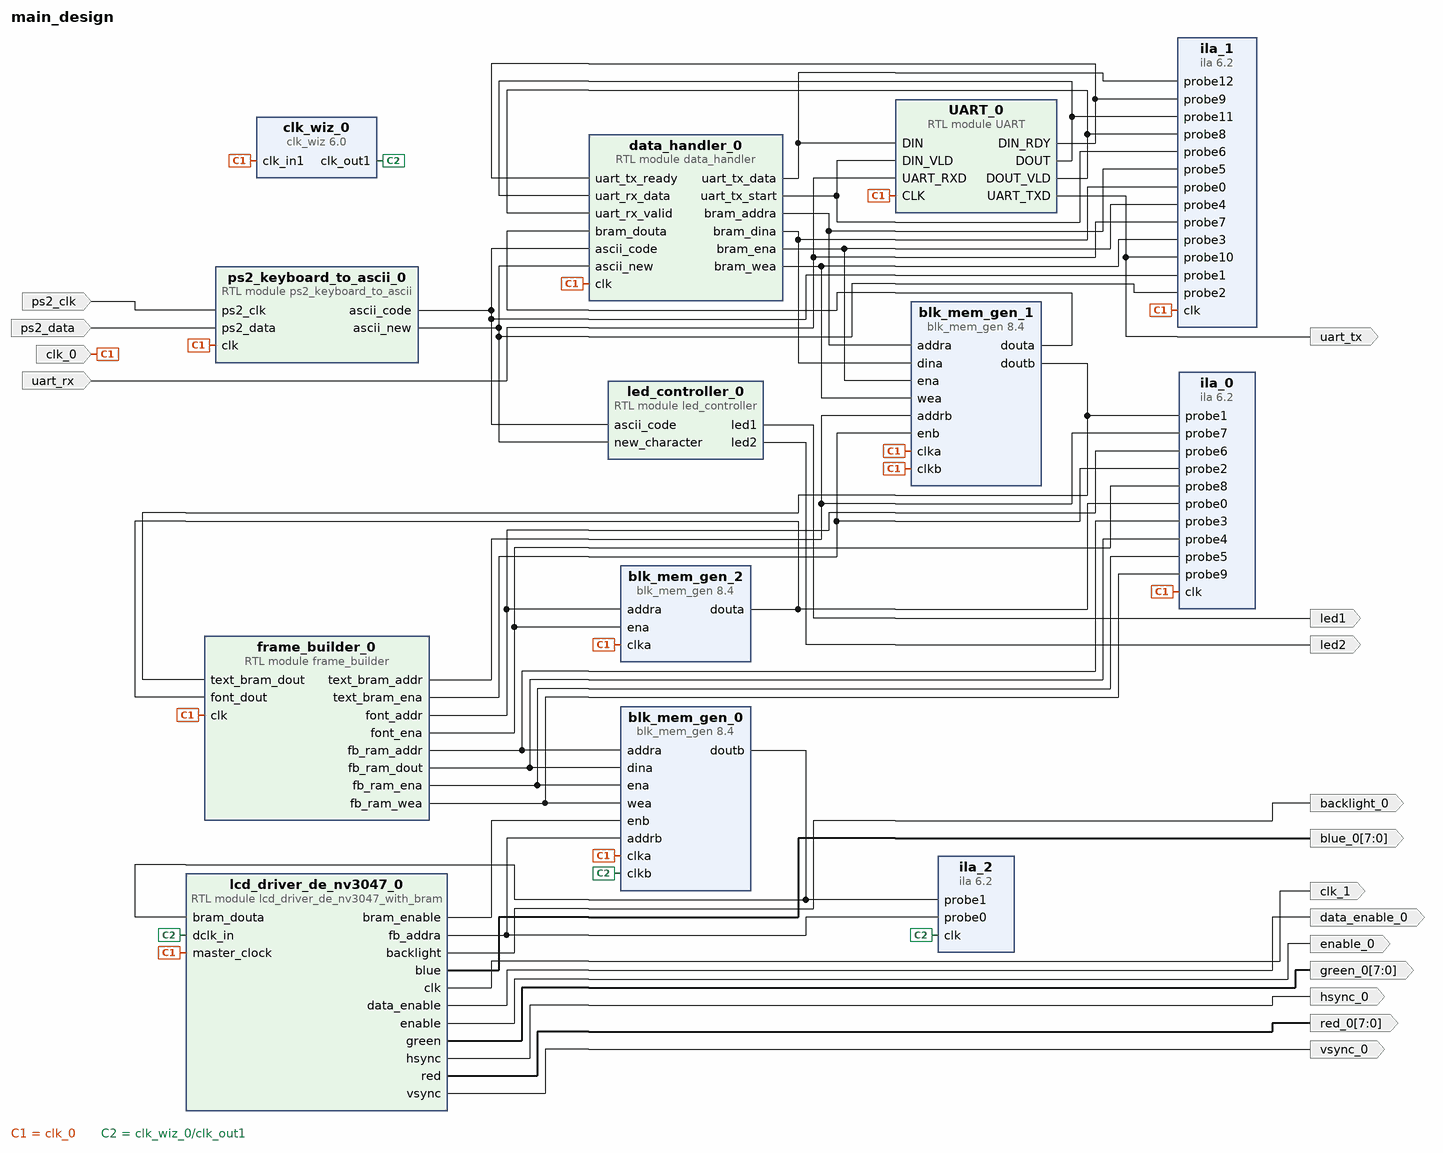
[diagram p0: block diagram of the top level]
# Vivado block design main_design, xc7a100tfgg676-1, Vivado 2025.1
create_bd_design main_design

create_bd_port -dir I -type clk clk_0
set_property -dict {CONFIG.FREQ_HZ 50000000} [get_bd_ports clk_0]
create_bd_port -dir O -type data led1
create_bd_port -dir O led2
create_bd_port -dir I -type data ps2_data
create_bd_port -dir I -type clk ps2_clk
set_property -dict {CONFIG.CLK_DOMAIN main_design_ps2_clk_0 CONFIG.FREQ_HZ 100000000} [get_bd_ports ps2_clk]
create_bd_port -dir I -type data uart_rx
create_bd_port -dir O -type data uart_tx
create_bd_port -dir O -from 7 -to 0 red_0
create_bd_port -dir O -from 7 -to 0 green_0
create_bd_port -dir O -from 7 -to 0 blue_0
create_bd_port -dir O enable_0
create_bd_port -dir O -type clk clk_1
create_bd_port -dir O hsync_0
create_bd_port -dir O vsync_0
create_bd_port -dir O data_enable_0
create_bd_port -dir O backlight_0

create_bd_cell -type module -reference ps2_keyboard_to_ascii ps2_keyboard_to_ascii_0
create_bd_cell -type module -reference led_controller led_controller_0
create_bd_cell -type module -reference UART UART_0
create_bd_cell -type ip -vlnv xilinx.com:ip:clk_wiz:6.0 clk_wiz_0
set_property -dict [list \
  CONFIG.CLKIN1_JITTER_PS 200.0 \
  CONFIG.CLKOUT1_DRIVES BUFG \
  CONFIG.CLKOUT1_JITTER 302.798 \
  CONFIG.CLKOUT1_PHASE_ERROR 161.614 \
  CONFIG.CLKOUT1_REQUESTED_OUT_FREQ 9 \
  CONFIG.CLKOUT2_DRIVES BUFG \
  CONFIG.CLKOUT3_DRIVES BUFG \
  CONFIG.CLKOUT4_DRIVES BUFG \
  CONFIG.CLKOUT5_DRIVES BUFG \
  CONFIG.CLKOUT6_DRIVES BUFG \
  CONFIG.CLKOUT7_DRIVES BUFG \
  CONFIG.MMCM_BANDWIDTH OPTIMIZED \
  CONFIG.MMCM_CLKFBOUT_MULT_F 18 \
  CONFIG.MMCM_CLKIN1_PERIOD 20.000 \
  CONFIG.MMCM_CLKIN2_PERIOD 10.0 \
  CONFIG.MMCM_CLKOUT0_DIVIDE_F 100 \
  CONFIG.MMCM_COMPENSATION ZHOLD \
  CONFIG.PLL_CLKIN_PERIOD 20.000 \
  CONFIG.PRIMITIVE PLL \
  CONFIG.PRIM_IN_FREQ 50 \
  CONFIG.PRIM_SOURCE No_buffer \
  CONFIG.USE_LOCKED false \
  CONFIG.USE_RESET false \
] [get_bd_cells clk_wiz_0]
create_bd_cell -type ip -vlnv xilinx.com:ip:blk_mem_gen:8.4 blk_mem_gen_0
set_property -dict [list \
  CONFIG.Enable_A Use_ENA_Pin \
  CONFIG.Fill_Remaining_Memory_Locations false \
  CONFIG.Load_Init_File false \
  CONFIG.Memory_Type True_Dual_Port_RAM \
  CONFIG.Operating_Mode_A NO_CHANGE \
  CONFIG.Register_PortB_Output_of_Memory_Primitives true \
  CONFIG.Use_Byte_Write_Enable false \
  CONFIG.Write_Depth_A 4080 \
  CONFIG.Write_Width_A 32 \
  CONFIG.Write_Width_B 32 \
  CONFIG.use_bram_block Stand_Alone \
] [get_bd_cells blk_mem_gen_0]
create_bd_cell -type module -reference lcd_driver_de_nv3047_with_bram lcd_driver_de_nv3047_0
create_bd_cell -type module -reference data_handler data_handler_0
create_bd_cell -type ip -vlnv xilinx.com:ip:blk_mem_gen:8.4 blk_mem_gen_1
set_property -dict [list \
  CONFIG.Fill_Remaining_Memory_Locations true \
  CONFIG.Load_Init_File false \
  CONFIG.Memory_Type True_Dual_Port_RAM \
  CONFIG.Write_Depth_A 17 \
  CONFIG.Write_Width_A 480 \
  CONFIG.use_bram_block Stand_Alone \
] [get_bd_cells blk_mem_gen_1]
create_bd_cell -type module -reference frame_builder frame_builder_0
create_bd_cell -type ip -vlnv xilinx.com:ip:blk_mem_gen:8.4 blk_mem_gen_2
set_property -dict [list \
  CONFIG.Coe_File ../../../../test_data/font.coe \
  CONFIG.Fill_Remaining_Memory_Locations false \
  CONFIG.Load_Init_File true \
  CONFIG.Memory_Type Single_Port_ROM \
  CONFIG.Write_Depth_A 2048 \
  CONFIG.Write_Width_A 8 \
  CONFIG.use_bram_block Stand_Alone \
] [get_bd_cells blk_mem_gen_2]
create_bd_cell -type ip -vlnv xilinx.com:ip:ila:6.2 ila_0
set_property -dict [list \
  CONFIG.C_MONITOR_TYPE Native \
  CONFIG.C_NUM_OF_PROBES 10 \
  CONFIG.C_PROBE0_WIDTH 8 \
  CONFIG.C_PROBE1_WIDTH 480 \
  CONFIG.C_PROBE2_WIDTH 1 \
  CONFIG.C_PROBE3_WIDTH 12 \
  CONFIG.C_PROBE4_WIDTH 32 \
  CONFIG.C_PROBE6_WIDTH 11 \
  CONFIG.C_PROBE7_WIDTH 5 \
] [get_bd_cells ila_0]
create_bd_cell -type ip -vlnv xilinx.com:ip:ila:6.2 ila_1
set_property -dict [list \
  CONFIG.C_MONITOR_TYPE Native \
  CONFIG.C_NUM_OF_PROBES 13 \
  CONFIG.C_PROBE0_WIDTH 480 \
  CONFIG.C_PROBE11_WIDTH 8 \
  CONFIG.C_PROBE12_WIDTH 8 \
  CONFIG.C_PROBE1_WIDTH 7 \
  CONFIG.C_PROBE5_WIDTH 5 \
] [get_bd_cells ila_1]
create_bd_cell -type ip -vlnv xilinx.com:ip:ila:6.2 ila_2
set_property -dict [list \
  CONFIG.C_MONITOR_TYPE Native \
  CONFIG.C_NUM_OF_PROBES 2 \
  CONFIG.C_PROBE0_WIDTH 12 \
  CONFIG.C_PROBE1_WIDTH 32 \
] [get_bd_cells ila_2]

# ---- connections ----

connect_bd_net [get_bd_pins lcd_driver_de_nv3047_0/bram_enable] [get_bd_pins blk_mem_gen_0/enb]
connect_bd_net [get_bd_pins blk_mem_gen_2/douta] [get_bd_pins ila_0/probe0] [get_bd_pins frame_builder_0/font_dout]
connect_bd_net [get_bd_pins UART_0/DIN_RDY] [get_bd_pins ila_1/probe9] [get_bd_pins data_handler_0/uart_tx_ready]
connect_bd_net [get_bd_pins UART_0/DOUT] [get_bd_pins ila_1/probe11] [get_bd_pins data_handler_0/uart_rx_data]
connect_bd_net [get_bd_pins UART_0/DOUT_VLD] [get_bd_pins ila_1/probe8] [get_bd_pins data_handler_0/uart_rx_valid]
connect_bd_net [get_bd_pins UART_0/UART_TXD] [get_bd_ports uart_tx] [get_bd_pins ila_1/probe10]
connect_bd_net [get_bd_pins blk_mem_gen_0/doutb] [get_bd_pins ila_2/probe1] [get_bd_pins lcd_driver_de_nv3047_0/bram_douta]
connect_bd_net [get_bd_pins blk_mem_gen_1/douta] [get_bd_pins data_handler_0/bram_douta]
connect_bd_net [get_bd_pins blk_mem_gen_1/doutb] [get_bd_pins ila_0/probe1] [get_bd_pins frame_builder_0/text_bram_dout]
connect_bd_net -net clk_0_1 [get_bd_ports clk_0] \
  [get_bd_pins ps2_keyboard_to_ascii_0/clk] [get_bd_pins UART_0/CLK] [get_bd_pins clk_wiz_0/clk_in1] \
  [get_bd_pins blk_mem_gen_1/clkb] [get_bd_pins ila_0/clk] [get_bd_pins ila_1/clk] [get_bd_pins blk_mem_gen_1/clka] \
  [get_bd_pins blk_mem_gen_2/clka] [get_bd_pins blk_mem_gen_0/clka] [get_bd_pins lcd_driver_de_nv3047_0/master_clock] \
  [get_bd_pins frame_builder_0/clk] [get_bd_pins data_handler_0/clk]
connect_bd_net [get_bd_pins clk_wiz_0/clk_out1] [get_bd_pins blk_mem_gen_0/clkb] [get_bd_pins ila_2/clk] [get_bd_pins lcd_driver_de_nv3047_0/dclk_in]
connect_bd_net [get_bd_pins data_handler_0/bram_addra] [get_bd_pins blk_mem_gen_1/addra] [get_bd_pins ila_1/probe5]
connect_bd_net [get_bd_pins data_handler_0/bram_dina] [get_bd_pins blk_mem_gen_1/dina] [get_bd_pins ila_1/probe0]
connect_bd_net [get_bd_pins data_handler_0/bram_ena] [get_bd_pins blk_mem_gen_1/ena] [get_bd_pins ila_1/probe4]
connect_bd_net [get_bd_pins data_handler_0/bram_wea] [get_bd_pins blk_mem_gen_1/wea] [get_bd_pins ila_1/probe3]
connect_bd_net [get_bd_pins data_handler_0/uart_tx_data] [get_bd_pins UART_0/DIN] [get_bd_pins ila_1/probe12]
connect_bd_net [get_bd_pins data_handler_0/uart_tx_start] [get_bd_pins UART_0/DIN_VLD] [get_bd_pins ila_1/probe6]
connect_bd_net [get_bd_pins frame_builder_0/fb_ram_addr] [get_bd_pins blk_mem_gen_0/addra] [get_bd_pins ila_0/probe3]
connect_bd_net [get_bd_pins frame_builder_0/fb_ram_dout] [get_bd_pins blk_mem_gen_0/dina] [get_bd_pins ila_0/probe4]
connect_bd_net [get_bd_pins frame_builder_0/fb_ram_ena] [get_bd_pins blk_mem_gen_0/ena] [get_bd_pins ila_0/probe5]
connect_bd_net [get_bd_pins frame_builder_0/fb_ram_wea] [get_bd_pins blk_mem_gen_0/wea] [get_bd_pins ila_0/probe9]
connect_bd_net [get_bd_pins frame_builder_0/font_addr] [get_bd_pins ila_0/probe6] [get_bd_pins blk_mem_gen_2/addra]
connect_bd_net [get_bd_pins frame_builder_0/font_ena] [get_bd_pins ila_0/probe8] [get_bd_pins blk_mem_gen_2/ena]
connect_bd_net -net frame_builder_0_text_addr [get_bd_pins frame_builder_0/text_bram_addr] \
  [get_bd_pins blk_mem_gen_1/addrb] [get_bd_pins ila_0/probe7]
connect_bd_net -net frame_builder_0_text_ena [get_bd_pins frame_builder_0/text_bram_ena] [get_bd_pins blk_mem_gen_1/enb] [get_bd_pins ila_0/probe2]
connect_bd_net [get_bd_pins lcd_driver_de_nv3047_0/backlight] [get_bd_ports backlight_0]
connect_bd_net [get_bd_pins lcd_driver_de_nv3047_0/blue] [get_bd_ports blue_0]
connect_bd_net [get_bd_pins lcd_driver_de_nv3047_0/clk] [get_bd_ports clk_1]
connect_bd_net [get_bd_pins lcd_driver_de_nv3047_0/data_enable] [get_bd_ports data_enable_0]
connect_bd_net [get_bd_pins lcd_driver_de_nv3047_0/enable] [get_bd_ports enable_0]
connect_bd_net [get_bd_pins lcd_driver_de_nv3047_0/fb_addra] [get_bd_pins blk_mem_gen_0/addrb] [get_bd_pins ila_2/probe0]
connect_bd_net [get_bd_pins lcd_driver_de_nv3047_0/green] [get_bd_ports green_0]
connect_bd_net [get_bd_pins lcd_driver_de_nv3047_0/hsync] [get_bd_ports hsync_0]
connect_bd_net [get_bd_pins lcd_driver_de_nv3047_0/red] [get_bd_ports red_0]
connect_bd_net [get_bd_pins lcd_driver_de_nv3047_0/vsync] [get_bd_ports vsync_0]
connect_bd_net [get_bd_pins led_controller_0/led1] [get_bd_ports led1]
connect_bd_net [get_bd_pins led_controller_0/led2] [get_bd_ports led2]
connect_bd_net [get_bd_ports ps2_clk] [get_bd_pins ps2_keyboard_to_ascii_0/ps2_clk]
connect_bd_net [get_bd_ports ps2_data] [get_bd_pins ps2_keyboard_to_ascii_0/ps2_data]
connect_bd_net [get_bd_pins ps2_keyboard_to_ascii_0/ascii_code] \
  [get_bd_pins led_controller_0/ascii_code] [get_bd_pins ila_1/probe1] [get_bd_pins data_handler_0/ascii_code]
connect_bd_net [get_bd_pins ps2_keyboard_to_ascii_0/ascii_new] \
  [get_bd_pins led_controller_0/new_character] [get_bd_pins ila_1/probe2] [get_bd_pins data_handler_0/ascii_new]
connect_bd_net [get_bd_ports uart_rx] [get_bd_pins UART_0/UART_RXD] [get_bd_pins ila_1/probe7]

validate_bd_design
save_bd_design
